# Altium schematic sheet CurrentSens.SchDoc
size A4; SheetNumber: 5; SheetTotal: 6
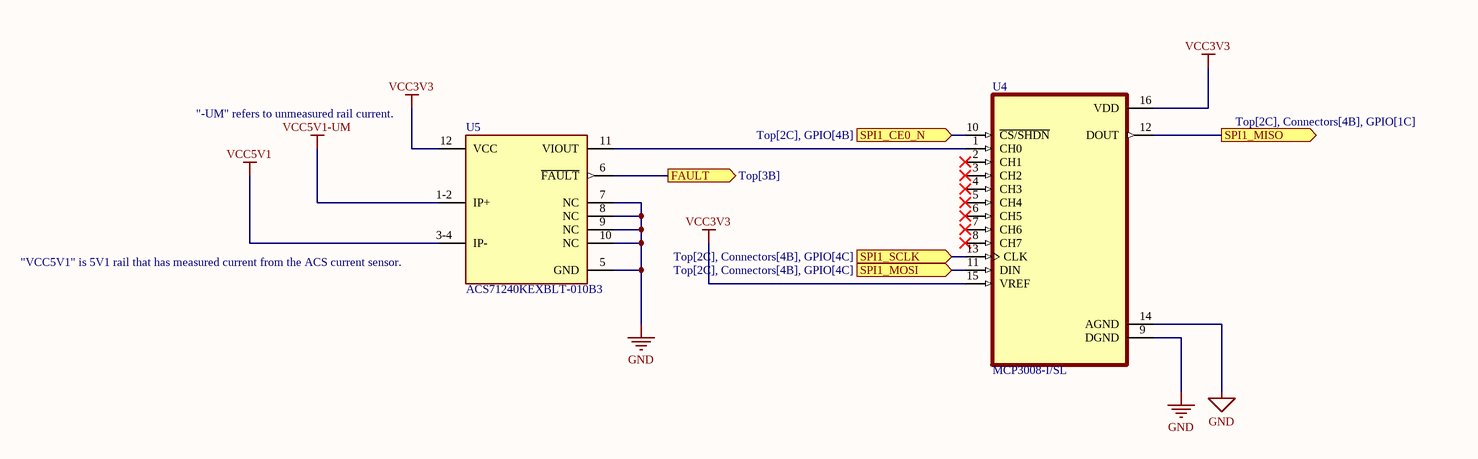
[diagram p0: CurrentSens.SchDoc]

## Parts
U4  MCP3008-I/SL  [SOIC127P600X175-16N]
U5  ACS71240KEXBLT-010B3  [FP-EXB-12-MFG]

## Ports
FAULT (out, see Top[3B]), SPI1_CE0_N (in, see Top[2C], GPIO[4B]), SPI1_MISO (out, see Top[2C], Connectors[4B], GPIO[1C]), SPI1_MOSI (in, see Top[2C], Connectors[4B], GPIO[4C]), SPI1_SCLK (in, see Top[2C], Connectors[4B], GPIO[4C])

## Nets
GND: U4.9(DGND) U4.14(AGND) U5.5(GND) U5.7(NC) U5.8(NC) U5.9(NC) U5.10(NC)
VCC3V3: U4.15(VREF) U4.16(VDD) U5.12(VCC)
VCC5V1: U5.3-4(IP-)
VCC5V1-UM: U5.1-2(IP+)
FAULT: U5.6(~{FAULT}) ; port FAULT
SPI1_CE0_N: U4.10(~{CS/SHDN}) ; port SPI1_CE0_N
SPI1_MISO: U4.12(DOUT) ; port SPI1_MISO
SPI1_MOSI: U4.11(DIN) ; port SPI1_MOSI
SPI1_SCLK: U4.13(CLK) ; port SPI1_SCLK
NetU4_1: U4.1(CH0) U5.11(VIOUT)

Not connected (* = marked no-connect by the designer): U4 2(CH1)* 3(CH2)* 4(CH3)* 5(CH4)* 6(CH5)* 7(CH6)* 8(CH7)*

## Notes on the sheet
- (near U5) "-UM" refers to unmeasured rail current.
- (near U5) "VCC5V1" is 5V1 rail that has measured current from the ACS current sensor.

## Library data of the parts
U4 = MCP3008-I/SL: 10 Bit Analog to Digital Converter 4, 8 Input 1 SAR 16-SOIC; MF: Microchip; Value: *; Price: None; Package: SOIC-16 Microchip; Check_prices: https://www.snapeda.com/parts/MCP3008-I/SL/Microchip/view-part/?ref=eda; Availability: In Stock; SnapEDA_Link: https://www.snapeda.com/parts/MCP3008-I/SL/Microchip/view-part/?ref=snap; MP: MCP3008-I/SL; Purchase-URL: https://pricing.snapeda.com/search/part/MCP3008-I/SL/?ref=eda
U5 = CMP-82923-000018-1: AUTOMOTIVE-GRADE, GALVANICALLY I